# Altium schematic sheet Slide_Switch.SchDoc
size A; SheetNumber: 3; SheetTotal: 7
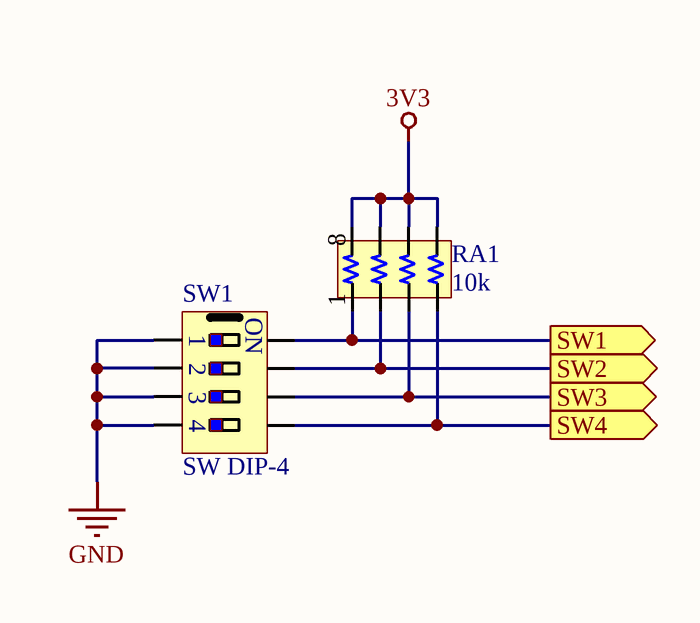
[diagram p0: Slide_Switch.SchDoc]

## Parts
RA1  10k  [RA4 1206 (3216)]
SW1  SW DIP-4  [SW/DIP4]

## Ports
SW1 (out, see ESP32_WROM_32[2B]), SW2 (out, see ESP32_WROM_32[2B]), SW3 (out, see ESP32_WROM_32[2B]), SW4 (out, see ESP32_WROM_32[2B])

## Nets
3V3: RA1.5 RA1.6 RA1.7 RA1.8
GND: SW1.1 SW1.2 SW1.3 SW1.4
SW1: RA1.1 SW1.8 ; port SW1
SW2: RA1.2 SW1.7 ; port SW2
SW3: RA1.3 SW1.6 ; port SW3
SW4: RA1.4 SW1.5 ; port SW4

## Notes on the sheet
- (in symbol SW DIP-4) ON

## Library data of the parts
RA1 = Resistor Array 4